# Altium schematic sheet Sheet2.SchDoc
size A4; SheetNumber: 2; SheetTotal: 2
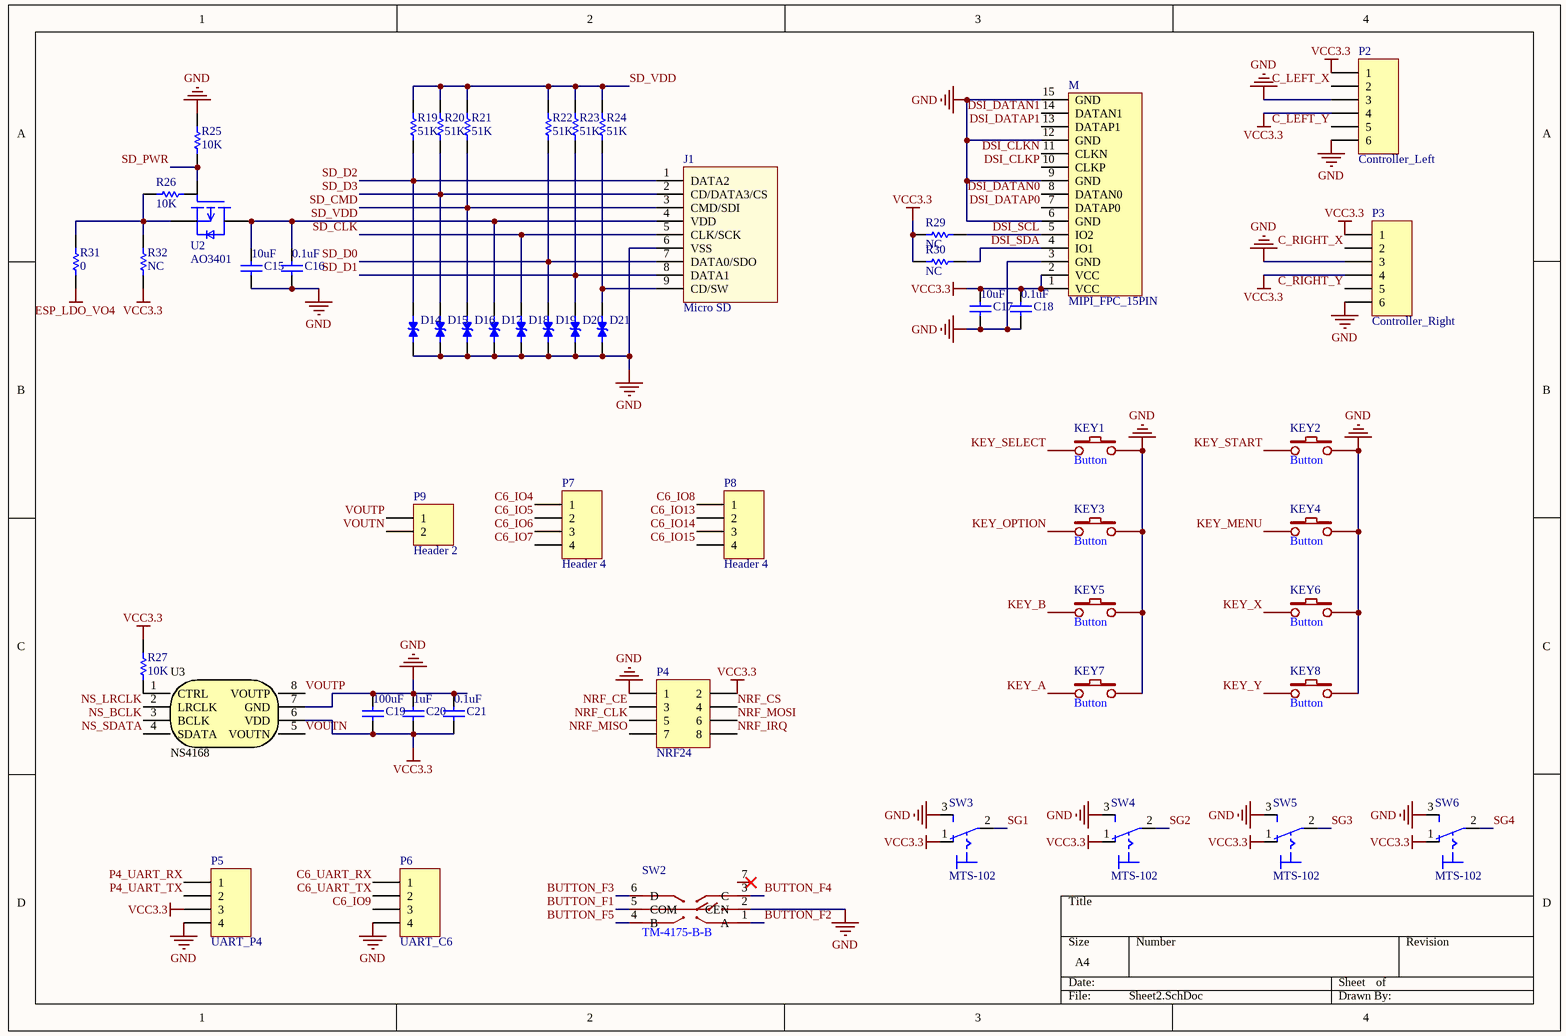
[diagram p0: Sheet2.SchDoc]

## Parts
C15  value 10uF  [C0805]  (hidden comment: 10uF/25v(20%))
C16  value 0.1uF  [C0805]  (hidden comment: 0.1uF/50V(10%))
C17  value 10uF  [C0805]  (hidden comment: 10uF/25v(20%))
C18  value 0.1uF  [C0805]  (hidden comment: 0.1uF/50V(10%))
C19  100uF  [C1206]
C20  1uF  [C0805]
C21  value 0.1uF  [C0805]  (hidden comment: 0.1uF/50V(10%))
D14  (no value)  [TVS_LESD5D5.0CT1G]
D15  (no value)  [TVS_LESD5D5.0CT1G]
D16  (no value)  [TVS_LESD5D5.0CT1G]
D17  (no value)  [TVS_LESD5D5.0CT1G]
D18  (no value)  [TVS_LESD5D5.0CT1G]
D19  (no value)  [TVS_LESD5D5.0CT1G]
D20  (no value)  [TVS_LESD5D5.0CT1G]
D21  (no value)  [TVS_LESD5D5.0CT1G]
J1  Micro SD  [Micro SD]
KEY1  Button  [SWITCH-A6]
KEY2  Button  [SWITCH-A6]
KEY3  Button  [SWITCH-A6]
KEY4  Button  [SWITCH-A6]
KEY5  Button  [SWITCH-A6]
KEY6  Button  [SWITCH-A6]
KEY7  Button  [SWITCH-A6]
KEY8  Button  [SWITCH-A6]
M  MIPI_FPC_15PIN  [FPC-SMD_15P-P1.00_HDGC_1.0K-GT-15PB]
P2  Controller_Left  [PH2.0-6P - SMT]
P3  Controller_Right  [PH2.0-6P - SMT]
P4  NRF24  [NRF24]
P5  UART_P4  [HDR1X4]
P6  UART_C6  [HDR1X4]
P7  Header 4  [HDR1X4]
P8  Header 4  [HDR1X4]
P9  Header 2  [XH2.54-2P]
R19  51K  [C0805]
R20  51K  [C0805]
R21  51K  [C0805]
R22  51K  [C0805]
R23  51K  [C0805]
R24  51K  [C0805]
R25  10K  [C0805]
R26  10K  [C0805]
R27  10K  [C0805]
R29  NC  [C0805]
R30  NC  [C0805]
R31  0  [C0805]
R32  NC  [C0805]
SW2  TM-4175-B-B  [TM4175-B-B]
SW3  MTS-102  [MTS-102]
SW4  MTS-102  [MTS-102]
SW5  MTS-102  [MTS-102]
SW6  MTS-102  [MTS-102]
U2  AO3401  [A03401]
U3  NS4168  [NS4168]

## Nets
ESP_LDO_VO4: R31.2
GND: C15.1 C16.1 C17.1 C18.1 C19.2 C20.2 C21.2 D14.1 D15.1 D16.1 D17.1 D18.1 D19.1 D20.1 D21.1 J1.6(VSS) KEY1.2 KEY2.2 KEY3.2 KEY4.2 KEY5.2 KEY6.2 KEY7.2 KEY8.2 M.3(GND) M.6(GND) M.9(GND) M.12(GND) M.15(GND) P2.3 P2.6 P3.3 P3.6 P4.1 P5.4 P6.4 R25.1 SW2.2(CEN) SW3.3(S) SW4.3(S) SW5.3(S) SW6.3(S) U3.7(GND)
VCC3.3: C17.2 C18.2 C19.1 C20.1 C21.1 M.1(VCC) M.2(VCC) P2.1 P2.4 P3.1 P3.4 P4.2 P5.3 R27.1 R29.2 R30.2 R32.2 SW3.1(O) SW4.1(O) SW5.1(O) SW6.1(O) U3.6(VDD)
BUTTON_F1: SW2.5(COM)
BUTTON_F2: SW2.1(A)
BUTTON_F3: SW2.6(D)
BUTTON_F4: SW2.3(C)
BUTTON_F5: SW2.4(B)
C6_IO4: P7.1
C6_IO5: P7.2
C6_IO6: P7.3
C6_IO7: P7.4
C6_IO8: P8.1
C6_IO9: P6.3
C6_IO13: P8.2
C6_IO14: P8.3
C6_IO15: P8.4
C6_UART_RX: P6.1
C6_UART_TX: P6.2
C_LEFT_X: P2.2
C_LEFT_Y: P2.5
C_RIGHT_X: P3.2
C_RIGHT_Y: P3.5
DSI_CLKN: M.11(CLKN)
DSI_CLKP: M.10(CLKP)
DSI_DATAN0: M.8(DATAN0)
DSI_DATAN1: M.14(DATAN1)
DSI_DATAP0: M.7(DATAP0)
DSI_DATAP1: M.13(DATAP1)
DSI_SCL: M.5(IO2) R29.1
DSI_SDA: M.4(IO1) R30.1
KEY_A: KEY7.1
KEY_B: KEY5.1
KEY_MENU: KEY4.1
KEY_OPTION: KEY3.1
KEY_SELECT: KEY1.1
KEY_START: KEY2.1
KEY_X: KEY6.1
KEY_Y: KEY8.1
NRF_CE: P4.3
NRF_CLK: P4.5
NRF_CS: P4.4
NRF_IRQ: P4.8
NRF_MISO: P4.7
NRF_MOSI: P4.6
NS_BCLK: U3.3(BCLK)
NS_LRCLK: U3.2(LRCLK)
NS_SDATA: U3.4(SDATA)
P4_UART_RX: P5.1
P4_UART_TX: P5.2
SD_CLK: D18.2 J1.5(CLK/SCK)
SD_CMD: D16.2 J1.3(CMD/SDI) R21.2
SD_D0: D19.2 J1.7(DATA0/SDO) R22.2
SD_D1: D20.2 J1.8(DATA1) R23.2
SD_D2: D14.2 J1.1(DATA2) R19.2
SD_D3: D15.2 J1.2(CD/DATA3/CS) R20.2
SD_PWR: R25.2 U2.1(G)
SD_VDD: C15.2 C16.2 D17.2 J1.4(VDD) R19.1 R20.1 R21.1 R22.1 R23.1 R24.1 U2.3(D)
SG1: SW3.2(P)
SG2: SW4.2(P)
SG3: SW5.2(P)
SG4: SW6.2(P)
VOUTN: P9.2 U3.5(VOUTN)
VOUTP: P9.1 U3.8(VOUTP)
NetD21_2: D21.2 J1.9(CD/SW) R24.2
NetR26_1: R26.1 R31.1 R32.1 U2.2(S)
NetR27_2: R27.2 U3.1(CTRL)

Not connected (* = marked no-connect by the designer): R26 2; SW2 7*

## Library data of the parts
C15-C21 = Cap: Capacitor; Published: 8-Jun-2000; LatestRevisionDate: 17-Jul-2002; LatestRevisionNote: Re-released for DXP Platform.; PackageReference: RAD-0.3; Publisher: Altium Limited; PackageDescription: Radial Cap, Thru-Hole; 2 Leads; 0.3 in Pin Spacing
  C19: Value: 100uF
  C20: Value: 1uF
D14-D21 = LESD5D5.0CT1G: Transient Voltage Suppressors for ESD Protection; MF: Leshan Radio Co.; Check_prices: https://www.snapeda.com/parts/LESD5D5.0CT1G/Leshan+Radio+Co./view-part/?ref=eda; Value: *; Availability: Not in stock; Package: None; SnapEDA_Link: https://www.snapeda.com/parts/LESD5D5.0CT1G/Leshan+Radio+Co./view-part/?ref=snap; MP: LESD5D5.0CT1G; Price: None
J1 = Micro SD: Micro SD卡; 版权归属: 源创客; BOM名称: Micro SD卡; 学习资源: www.ooocke.com
KEY1-KEY8 = Button: A6按键; Manufacturer: 韩国韩荣; Symbol: K2-1817UQ-C4SW-01; Add into BOM: yes; Contact Current: 50mA; Voltage Rating (DC): 12V; Insulation Resistance: 100MΩ; Circuit: 单刀单掷; Actuator Style: 圆形按钮; Operating Force: 250gf@±30gf; Mechanical Life: 100000; Switch Length: 6mm; Switch Height: 5mm; Device: K2-1817UQ-C4SW-01; LCSC Part Name: 无声开关 6.0mm*6.0mm*5mm  250G; Supplier Part: C128939; Manufacturer Part: K2-1817UQ-C4SW-01; Supplier Footprint: SMD; JLCPCB Part Class: 扩展库; Datasheet: https://atta.szlcsc.com/upload/public/pdf/source/20210322/C2690010_58F7DD7E136B4BFA712F0D44F3FEADD9.pdf; Supplier: LCSC; Convert to PCB: yes; Mounting Style: 立贴; With Lamp: -; Operating Temperature: -25℃~+85℃; Switch Width: 6mm
M = MIPI_FPC_15PIN: 立式
P2 P3 = Header 6: Header, 6-Pin; LatestRevisionDate: 17-Jul-2002; LatestRevisionNote: Re-released for DXP Platform.; Publisher: Altium Limited
P4 = Header 4X2: Header, 4-Pin, Dual row; LatestRevisionDate: 17-Jul-2002; LatestRevisionNote: Re-released for DXP Platform.; Publisher: Altium Limited
P5-P8 = Header 4: Header, 4-Pin; LatestRevisionDate: 17-Jul-2002; LatestRevisionNote: Re-released for DXP Platform.; Publisher: Altium Limited
P9 = Header 2: Header, 2-Pin; LatestRevisionDate: 17-Jul-2002; LatestRevisionNote: Re-released for DXP Platform.; Publisher: Altium Limited
R19-R27 R29-R32 = Res1: Resistor; Published: 8-Jun-2000; LatestRevisionDate: 17-Jul-2002; LatestRevisionNote: Re-released for DXP Platform.; PackageReference: AXIAL-0.3; Publisher: Altium Limited; PackageDescription: Axial Device, Thru-Hole; 2 Leads; 0.3 in Pin Spacing
SW2 = TM-4175-B-B: Manufacturer: XKB Connectivity(中国星坤); Add into BOM: yes; Symbol: TM-4175-B-B; Device: TM-4175-B-B; Supplier: LCSC; Supplier Part: C465996; Manufacturer Part: TM-4175-B-B; JLCPCB Part Class: 扩展库; LCSC Part Name: 7.5*7.5*6五向开关 H6 升级减少摇晃 显示器五向开关; Supplier Footprint: SMD-8P,7.5x7.5mm; Datasheet: https://atta.szlcsc.com/upload/public/pdf/source/20211011/A0F6117F2AB0E02F6CF3847B7456F266.pdf; Convert to PCB: yes
SW3-SW6 = MTS-102: Rectangular Cable Assemblies .100 Mini Mate Single Row Discrete Wire Cable Assembly, Terminal; MF: Motorola; MP: MTS102; Availability: Unavailable; Value: *; Package: None; SnapEDA_Link: https://www.snapeda.com/parts/MTS102/Motorola/view-part/698799/?ref=snap; Price: None; Check_prices: https://www.snapeda.com/parts/MTS102/Motorola/view-part/698799/?ref=eda
U2 = AO3401: P-Channel 30 V 4A (Ta) 1.4W (Ta) Surface Mount SOT-23-3; MF: Alpha & Omega Semiconductor; SnapEDA_Link: https://www.snapeda.com/parts/AO3401/Alpha/view-part/?ref=snap; Package: SOT-23-3 Alpha &amp; Omega Semiconductor; Value: *; MP: AO3401; Check_prices: https://www.snapeda.com/parts/AO3401/Alpha/view-part/?ref=eda
U3 = NS4168: Add into BOM: yes; Symbol: NS4168; Device: NS4168; Convert to PCB: yes